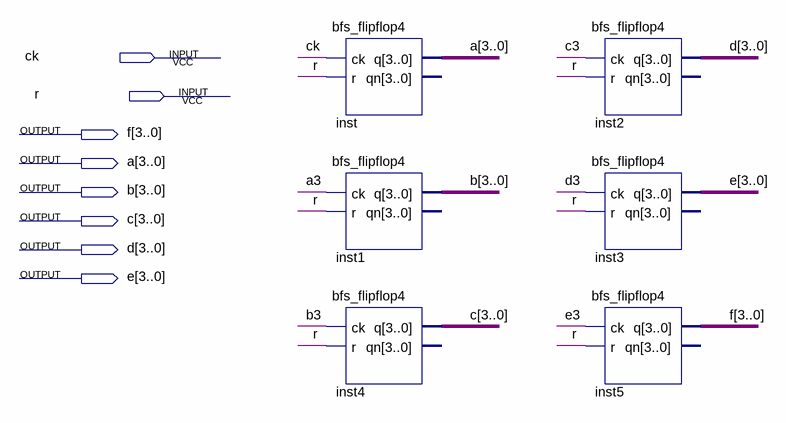
[diagram p0: schematic sheet]
// Quartus schematic bfs_divisor24.bdf as structural Verilog: 6 symbols, 8 pins
module bfs_divisor24 (
  input  ck,
  input  r,
  output [3:0] f,
  output [3:0] a,
  output [3:0] b,
  output [3:0] c,
  output [3:0] d,
  output [3:0] e
);

  bfs_flipflop4 inst (.ck(ck), .r(r), .q(a));  // open: qn
  bfs_flipflop4 inst1 (.ck(a[3]), .r(r), .q(b));  // open: qn
  bfs_flipflop4 inst4 (.ck(b[3]), .r(r), .q(c));  // open: qn
  bfs_flipflop4 inst2 (.ck(c[3]), .r(r), .q(d));  // open: qn
  bfs_flipflop4 inst3 (.ck(d[3]), .r(r), .q(e));  // open: qn
  bfs_flipflop4 inst5 (.ck(e[3]), .r(r), .q(f));  // open: qn
endmodule
